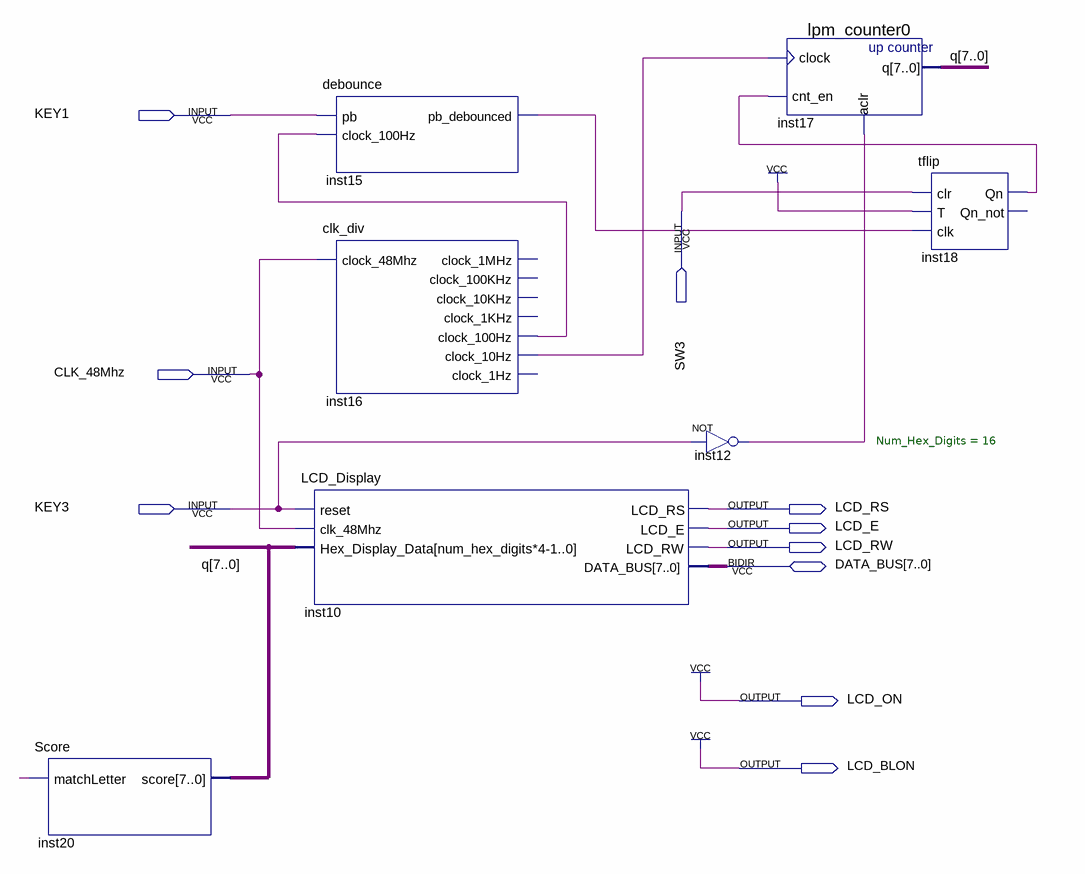
[diagram p0: schematic sheet]
// Quartus schematic countercomp.bdf as structural Verilog: 7 symbols, 10 pins
module countercomp (
  input  KEY1,
  input  SW3,
  input  CLK_48Mhz,
  input  KEY3,
  inout  [7:0] DATA_BUS,
  output LCD_RS,
  output LCD_E,
  output LCD_RW,
  output LCD_ON,
  output LCD_BLON
);

  wire inst12_out, inst15_pb_debounced, inst16_clock_10hz, inst16_clock_100hz, inst18_qn, undriven;
  wire [7:0] q;

  Score inst20 (.matchLetter(undriven), .score(q));
  debounce inst15 (.pb(KEY1), .clock_100Hz(inst16_clock_100hz), .pb_debounced(inst15_pb_debounced));
  clk_div inst16 (
    .clock_48Mhz(CLK_48Mhz), .clock_100Hz(inst16_clock_100hz), .clock_10Hz(inst16_clock_10hz));  // open: clock_1MHz, clock_100KHz, clock_10KHz, clock_1KHz, clock_1Hz
  LCD_Display #(.Num_Hex_Digits(16)) inst10 (
    .reset(KEY3), .clk_48Mhz(CLK_48Mhz), .Hex_Display_Data(q), .LCD_RS(LCD_RS), .LCD_E(LCD_E),
    .LCD_RW(LCD_RW), .DATA_BUS(DATA_BUS));
  not inst12 (inst12_out, KEY3);
  lpm_counter0 inst17 (.clock(inst16_clock_10hz), .cnt_en(inst18_qn), .aclr(inst12_out), .q(q));
  tflip inst18 (.clr(SW3), .T(1'b1), .clk(inst15_pb_debounced), .Qn(inst18_qn));  // open: Qn_not

  assign LCD_BLON = 1'b1;
  assign LCD_ON = 1'b1;
endmodule
